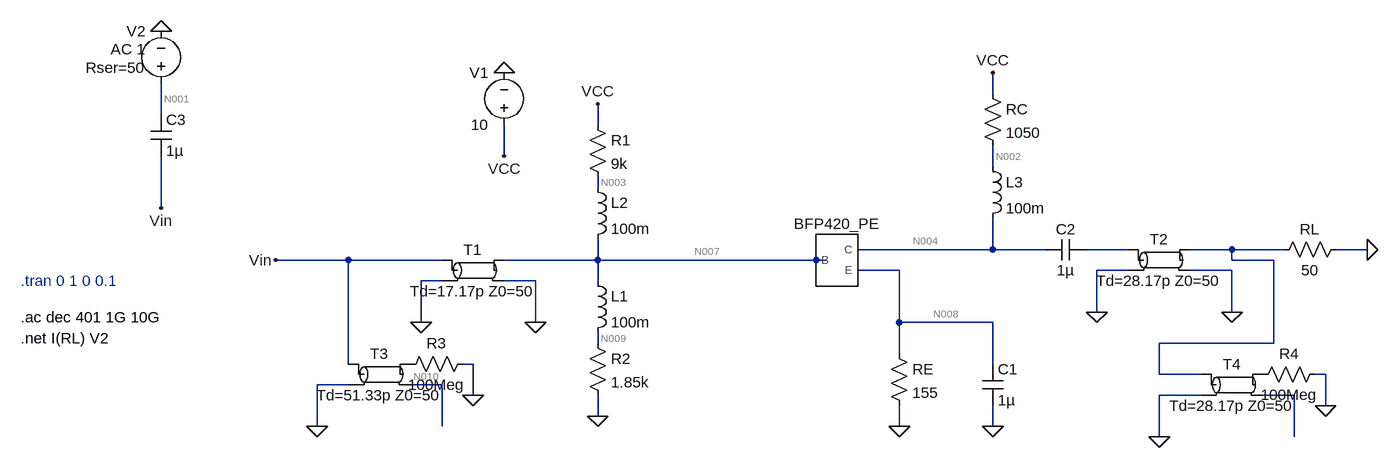
[diagram p0: schematic LNA_adapt_LS.asc]
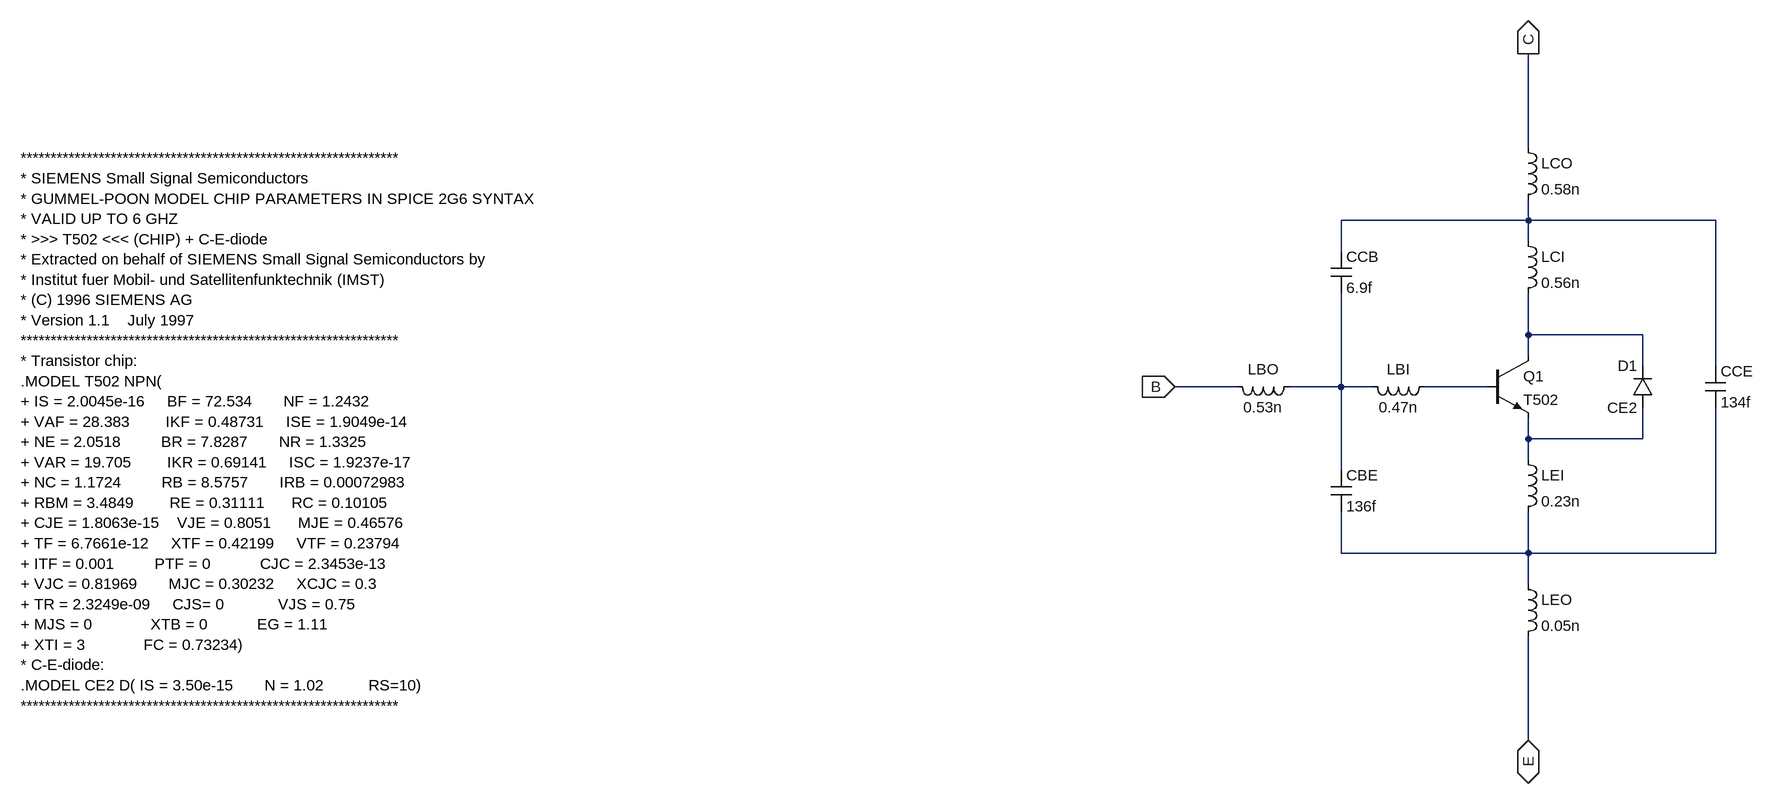
[diagram p1: sub-circuit transistor.asc]
LNA_adapt_LS.asc, the LTspice schematic file:
Version 4.1
SHEET 1 1396 724
WIRE 496 -96 496 -128
WIRE -784 -64 -784 -112
WIRE -112 -48 -112 -80
WIRE -256 0 -256 -48
WIRE 496 16 496 -16
WIRE -112 48 -112 32
WIRE -784 80 -784 0
WIRE 496 144 496 96
WIRE 496 144 288 144
WIRE 576 144 496 144
WIRE 704 144 640 144
WIRE 864 144 800 144
WIRE 944 144 864 144
WIRE 1072 144 1024 144
WIRE -496 160 -608 160
WIRE -352 160 -496 160
WIRE -112 160 -112 128
WIRE -112 160 -256 160
WIRE 224 160 -112 160
WIRE 240 160 224 160
WIRE 864 160 864 144
WIRE 928 160 864 160
WIRE 352 176 288 176
WIRE 704 176 656 176
WIRE 864 176 800 176
WIRE -352 192 -384 192
WIRE -208 192 -256 192
WIRE -112 192 -112 160
WIRE 656 240 656 176
WIRE 864 240 864 176
WIRE -384 256 -384 192
WIRE -208 256 -208 192
WIRE 352 256 352 176
WIRE 496 256 352 256
WIRE -112 288 -112 272
WIRE 928 288 928 160
WIRE 928 288 752 288
WIRE 352 304 352 256
WIRE -496 320 -496 160
WIRE -304 320 -320 320
WIRE 496 320 496 256
WIRE 752 336 752 288
WIRE 816 336 752 336
WIRE 1008 336 992 336
WIRE -496 352 -544 352
WIRE -352 352 -400 352
WIRE -304 368 -304 320
WIRE 816 368 752 368
WIRE 960 368 912 368
WIRE 1008 384 1008 336
WIRE -112 400 -112 368
WIRE -544 416 -544 352
WIRE -352 416 -352 352
WIRE 352 416 352 384
WIRE 496 416 496 384
WIRE 752 432 752 368
WIRE 960 432 960 368
FLAG -256 -128 0
FLAG -112 400 0
FLAG 352 416 0
FLAG -256 0 VCC
FLAG -112 -80 VCC
FLAG 496 -128 VCC
FLAG 496 416 0
FLAG -784 -192 0
FLAG -784 80 Vin
FLAG -608 160 Vin
FLAG 1072 144 0
FLAG -544 416 0
FLAG -304 368 0
FLAG -384 256 0
FLAG -208 256 0
FLAG 656 240 0
FLAG 864 240 0
FLAG 752 432 0
FLAG 1008 384 0
SYMBOL res 480 -112 R0
SYMATTR InstName RC
SYMATTR Value 1050
SYMBOL res 336 288 R0
SYMATTR InstName RE
SYMATTR Value 155
SYMBOL res -128 272 R0
SYMATTR InstName R2
SYMATTR Value 1.85k
SYMBOL res -128 -64 R0
SYMATTR InstName R1
SYMATTR Value 9k
SYMBOL voltage -256 -32 R180
WINDOW 0 24 96 Left 2
WINDOW 3 24 16 Left 2
WINDOW 123 0 0 Left 0
WINDOW 39 0 0 Left 0
SYMATTR InstName V1
SYMATTR Value 10
SYMBOL transistor 256 160 R0
SYMATTR InstName BFP420_PE
SYMBOL cap 480 320 R0
SYMATTR InstName C1
SYMATTR Value 1µ
SYMBOL ind -128 176 R0
SYMATTR InstName L1
SYMATTR Value 100m
SYMBOL ind -128 32 R0
SYMATTR InstName L2
SYMATTR Value 100m
SYMBOL ind 480 0 R0
SYMATTR InstName L3
SYMATTR Value 100m
SYMBOL res 1040 128 R90
WINDOW 0 0 56 VBottom 2
WINDOW 3 32 56 VTop 2
SYMATTR InstName RL
SYMATTR Value 50
SYMBOL cap 640 128 R90
WINDOW 0 0 32 VBottom 2
WINDOW 3 32 32 VTop 2
SYMATTR InstName C2
SYMATTR Value 1µ
SYMBOL voltage -784 -96 R180
WINDOW 0 24 96 Left 2
WINDOW 3 24 16 Left 2
WINDOW 123 24 68 Left 2
WINDOW 39 24 40 Left 2
SYMATTR InstName V2
SYMATTR Value ""
SYMATTR Value2 AC 1
SYMATTR SpiceLine Rser=50
SYMBOL cap -800 -64 R0
SYMATTR InstName C3
SYMATTR Value 1µ
SYMBOL tline -304 176 R0
SYMATTR InstName T1
SYMATTR Value Td=17.17p Z0=50
SYMBOL tline 752 160 R0
SYMATTR InstName T2
SYMATTR Value Td=28.17p Z0=50
SYMBOL tline -448 336 R0
SYMATTR InstName T3
SYMATTR Value Td=51.33p Z0=50
SYMBOL tline 864 352 R0
SYMATTR InstName T4
SYMATTR Value Td=28.17p Z0=50
SYMBOL res -304 304 R90
WINDOW 0 0 56 VBottom 2
WINDOW 3 32 56 VTop 2
SYMATTR InstName R3
SYMATTR Value 100Meg
SYMBOL res 1008 320 R90
WINDOW 0 0 56 VBottom 2
WINDOW 3 32 56 VTop 2
SYMATTR InstName R4
SYMATTR Value 100Meg
TEXT -1000 248 Left 2 !.ac dec 401 1G 10G
TEXT -1000 280 Left 2 !.net I(RL) V2
TEXT -1000 192 Left 2 ;.tran 0 1 0 0.1

transistor.asc, the sub-circuit schematic file:
Version 4.1
SHEET 1 2192 680
WIRE 1840 -416 1840 -560
WIRE 1840 -304 1840 -336
WIRE 1840 -304 1552 -304
WIRE 2128 -304 1840 -304
WIRE 1840 -272 1840 -304
WIRE 1552 -256 1552 -304
WIRE 1840 -128 1840 -192
WIRE 2016 -128 1840 -128
WIRE 1840 -96 1840 -128
WIRE 2016 -80 2016 -128
WIRE 2128 -80 2128 -304
WIRE 1392 -48 1296 -48
WIRE 1552 -48 1552 -192
WIRE 1552 -48 1472 -48
WIRE 1600 -48 1552 -48
WIRE 1776 -48 1680 -48
WIRE 1840 32 1840 0
WIRE 2016 32 2016 -16
WIRE 2016 32 1840 32
WIRE 1840 64 1840 32
WIRE 1552 80 1552 -48
WIRE 1552 208 1552 144
WIRE 1840 208 1840 144
WIRE 1840 208 1552 208
WIRE 2128 208 2128 -16
WIRE 2128 208 1840 208
WIRE 1840 256 1840 208
WIRE 1840 496 1840 336
FLAG 1840 496 E
IOPIN 1840 496 BiDir
FLAG 1296 -48 B
IOPIN 1296 -48 In
FLAG 1840 -560 C
IOPIN 1840 -560 Out
SYMBOL npn 1776 -96 R0
SYMATTR InstName Q1
SYMATTR Value T502
SYMBOL ind 1824 48 R0
SYMATTR InstName LEI
SYMATTR Value 0.23n
SYMBOL ind 1824 240 R0
SYMATTR InstName LEO
SYMATTR Value 0.05n
SYMBOL ind 1824 -288 R0
SYMATTR InstName LCI
SYMATTR Value 0.56n
SYMBOL ind 1824 -432 R0
SYMATTR InstName LCO
SYMATTR Value 0.58n
SYMBOL ind 1696 -64 R90
WINDOW 0 5 56 VBottom 2
WINDOW 3 32 56 VTop 2
SYMATTR InstName LBI
SYMATTR Value 0.47n
SYMBOL ind 1488 -64 R90
WINDOW 0 5 56 VBottom 2
WINDOW 3 32 56 VTop 2
SYMATTR InstName LBO
SYMATTR Value 0.53n
SYMBOL cap 2112 -80 R0
SYMATTR InstName CCE
SYMATTR Value 134f
SYMBOL cap 1536 -256 R0
SYMATTR InstName CCB
SYMATTR Value 6.9f
SYMBOL cap 1536 80 R0
SYMATTR InstName CBE
SYMATTR Value 136f
SYMBOL diode 2032 -16 R180
WINDOW 0 24 64 Left 2
WINDOW 3 24 0 Left 2
SYMATTR InstName D1
SYMATTR Value CE2
TEXT -480 -400 Left 2 !***************************************************************\n* SIEMENS Small Signal Semiconductors\n* GUMMEL-POON MODEL CHIP PARAMETERS IN SPICE 2G6 SYNTAX\n* VALID UP TO 6 GHZ\n* >>> T502 <<< (CHIP) + C-E-diode\n* Extracted on behalf of SIEMENS Small Signal Semiconductors by\n* Institut fuer Mobil- und Satellitenfunktechnik (IMST)\n* (C) 1996 SIEMENS AG\n* Version 1.1    July 1997\n***************************************************************\n* Transistor chip:\n.MODEL T502 NPN(\n+ IS = 2.0045e-16     BF = 72.534       NF = 1.2432\n+ VAF = 28.383        IKF = 0.48731     ISE = 1.9049e-14\n+ NE = 2.0518         BR = 7.8287       NR = 1.3325\n+ VAR = 19.705        IKR = 0.69141     ISC = 1.9237e-17\n+ NC = 1.1724         RB = 8.5757       IRB = 0.00072983\n+ RBM = 3.4849        RE = 0.31111      RC = 0.10105\n+ CJE = 1.8063e-15    VJE = 0.8051      MJE = 0.46576\n+ TF = 6.7661e-12     XTF = 0.42199     VTF = 0.23794\n+ ITF = 0.001         PTF = 0           CJC = 2.3453e-13\n+ VJC = 0.81969       MJC = 0.30232     XCJC = 0.3\n+ TR = 2.3249e-09     CJS= 0            VJS = 0.75\n+ MJS = 0             XTB = 0           EG = 1.11\n+ XTI = 3             FC = 0.73234)\n* C-E-diode:\n.MODEL CE2 D( IS = 3.50e-15       N = 1.02          RS=10)\n***************************************************************

The netlist it stands for:
* LNA_adapt_LS.asc
RC VCC N002 1050
RE N008 0 155
R2 N009 0 1.85k
R1 VCC N003 9k
V1 VCC 0 10
X§BFP420_PE N007 N004 N008 transistor
C1 N008 0 1µ
L1 N007 N009 100m
L2 N003 N007 100m
L3 N002 N004 100m
RL 0 N006 50
C2 N005 N004 1µ
V2 N001 0 AC 1 Rser=50
C3 N001 Vin 1µ
T1 Vin 0 N007 0 Td=17.17p Z0=50
T2 N005 0 N006 0 Td=28.17p Z0=50
T3 Vin 0 P001 N010 Td=51.33p Z0=50
T4 N006 0 P002 N011 Td=28.17p Z0=50
R3 0 P001 100Meg
R4 0 P002 100Meg

* block symbol definitions
.subckt transistor B C E
Q1 N002 N004 N005 0 T502
LEI N005 N006 0.23n
LEO N006 E 0.05n
LCI N001 N002 0.56n
LCO C N001 0.58n
LBI N004 N003 0.47n
LBO N003 B 0.53n
CCE N001 N006 134f
CCB N001 N003 6.9f
CBE N003 N006 136f
D1 N005 N002 CE2
***************************************************************
* SIEMENS Small Signal Semiconductors
* GUMMEL-POON MODEL CHIP PARAMETERS IN SPICE 2G6 SYNTAX
* VALID UP TO 6 GHZ
* >>> T502 <<< (CHIP) + C-E-diode
* Extracted on behalf of SIEMENS Small Signal Semiconductors by
* Institut fuer Mobil- und Satellitenfunktechnik (IMST)
* (C) 1996 SIEMENS AG
* Version 1.1    July 1997
***************************************************************
* Transistor chip:
.MODEL T502 NPN(
+ IS = 2.0045e-16     BF = 72.534       NF = 1.2432
+ VAF = 28.383        IKF = 0.48731     ISE = 1.9049e-14
+ NE = 2.0518         BR = 7.8287       NR = 1.3325
+ VAR = 19.705        IKR = 0.69141     ISC = 1.9237e-17
+ NC = 1.1724         RB = 8.5757       IRB = 0.00072983
+ RBM = 3.4849        RE = 0.31111      RC = 0.10105
+ CJE = 1.8063e-15    VJE = 0.8051      MJE = 0.46576
+ TF = 6.7661e-12     XTF = 0.42199     VTF = 0.23794
+ ITF = 0.001         PTF = 0           CJC = 2.3453e-13
+ VJC = 0.81969       MJC = 0.30232     XCJC = 0.3
+ TR = 2.3249e-09     CJS= 0            VJS = 0.75
+ MJS = 0             XTB = 0           EG = 1.11
+ XTI = 3             FC = 0.73234)
* C-E-diode:
.MODEL CE2 D( IS = 3.50e-15       N = 1.02          RS=10)
***************************************************************
.ends transistor

.model D D
.lib standard.dio
.model NPN NPN
.model PNP PNP
.lib standard.bjt
.ac dec 401 1G 10G
.net I(RL) V2
* .tran 0 1 0 0.1
.backanno
.end

* Results of the author's LTspice run, read from the files saved beside the schematic
* Operating Point, zero values left out:
*   V(n002) = 5.732 V
*   V(n003) = 1.623 V
*   V(n004) = 5.732 V
*   V(n007) = 1.623 V
*   V(n008) = 638.4 mV
*   V(n009) = 1.623 V
*   V(n010) = -1.623 V
*   V(vcc) = 10 V
*   V(vin) = 1.623 V
*   I(L1) = 877.1 µA
*   I(L2) = 930.8 µA
*   I(L3) = 4.065 mA
*   I(R1) = 930.8 µA
*   I(R2) = 877.1 µA
*   I(RC) = 4.065 mA
*   I(RE) = 4.119 mA
*   I(V1) = -4.996 mA
*   Ix(bfp420_pe:b) = 53.67 µA
*   Ix(bfp420_pe:c) = 4.065 mA
*   Ix(bfp420_pe:e) = -4.119 mA
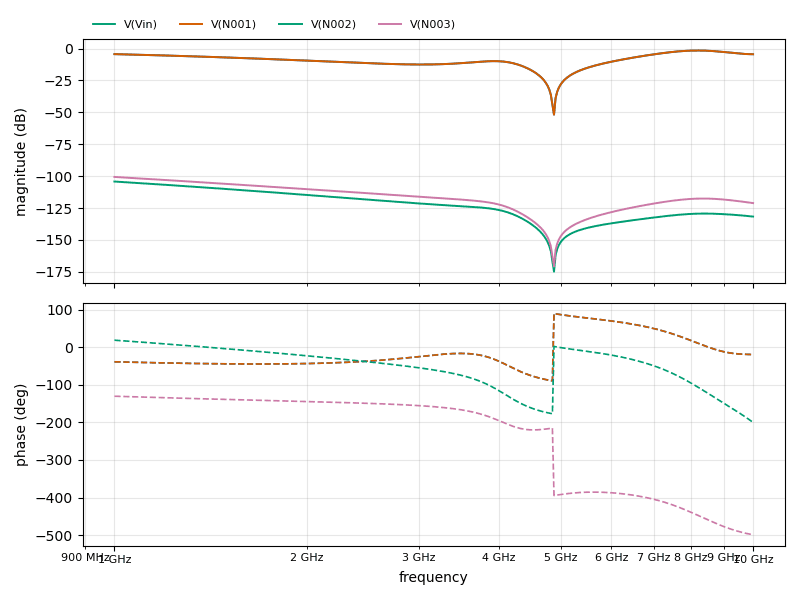
[diagram p2: AC Analysis of LNA_adapt_LS.asc, plotted from the saved traces]
* AC Analysis, 1 run:
*   V(Vin): -4.34 dB at 1 GHz, -4.42 dB at 10 GHz, peak -1.50 dB at 8.179 GHz, 3 dB below the peak at 6.992 GHz
*   V(N001): -4.34 dB at 1 GHz, -4.42 dB at 10 GHz, peak -1.50 dB at 8.179 GHz, 3 dB below the peak at 6.992 GHz
*   V(N002): -104.24 dB at 1 GHz, -131.73 dB at 10 GHz, peak -104.24 dB at 1 GHz, 3 dB below the peak at 1.238 GHz
*   V(N003): -100.64 dB at 1 GHz, -121.15 dB at 10 GHz, peak -100.64 dB at 1 GHz, 3 dB below the peak at 1.255 GHz